# Altium schematic sheet Button_Input_Block.SchDoc
size A; SheetNumber: 8; SheetTotal: 10
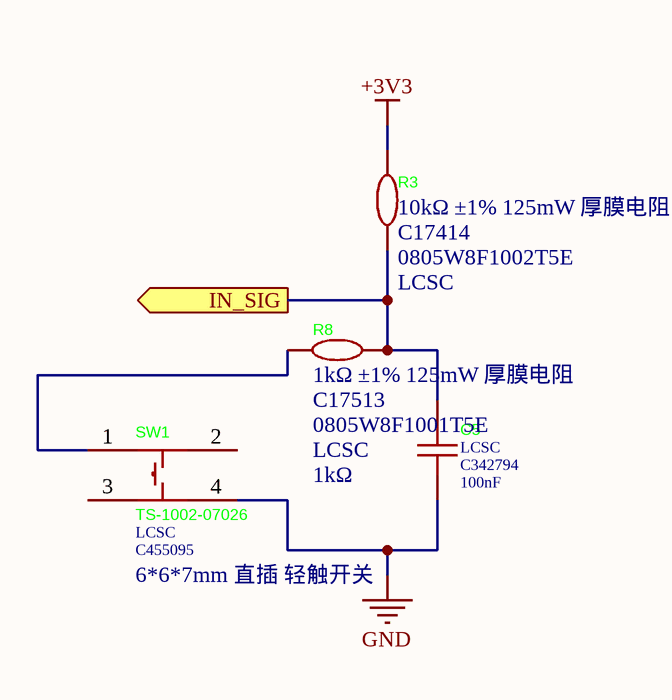
[diagram p0: Button_Input_Block.SchDoc]

## Parts
C5  Supplier: LCSC  Supplier Part: C342794  [CAP-TH_L4.0-W2.5-P5.00-D1.0]  (hidden comment: 100nF)
R3  LCSC Part Name: 10kΩ ±1% 125mW 厚膜电阻  Supplier Part: C17414  Supplier: LCSC  [R0805]  (hidden comment: 10kΩ)
R8  LCSC Part Name: 1kΩ ±1% 125mW 厚膜电阻  Supplier Part: C17513  Supplier: LCSC  [R0805]  (hidden comment: 1kΩ)
SW1  TS-1002-07026  Supplier: LCSC  Supplier Part: C455095  LCSC Part Name: 6*6*7mm 直插 轻触开关  [SW-TH_4P-L6.0-W6.0-P4.50-LS6.5]

## Ports
IN_SIG (out)

## Nets
+3V3: R3.2
GND: C5.1 SW1.4
IN_SIG: C5.2 R3.1 R8.2 ; port IN_SIG
NetR8_1: R8.1 SW1.1

Not connected (* = marked no-connect by the designer): SW1 2 3

## Library data of the parts
C5 = FG28X7R1H104KNT06: Manufacturer: TDK; Add into BOM: yes; Tolerance: ±10%; Voltage Rating: 50V; Temperature Coefficient: X7R; Pin Spacing: 5mm; Symbol: FG28X7R1H104KNT06; Device: FG28X7R1H104KNT06; LCSC Part Name: 100nF ±10% 50V; Manufacturer Part: FG28X7R1H104KNT06; Supplier Footprint: 插件,P=5mm; JLCPCB Part Class: Extended Part; Datasheet: https://item.szlcsc.com/datasheet/FG28X7R1H104KNT06/319644.html; Convert to PCB: yes; Value: 100nF
R3 = 0805W8F1002T5E: Manufacturer: UNI-ROYAL(厚声); Add into BOM: yes; Tolerance: ±1%; Power(Watts): 125mW; Voltage-Supply(Max): 150V; Temperature Coefficient: ±100ppm/℃; Symbol: 0805W8F1002T5E; Device: 0805W8F1002T5E; Value: 10kΩ; Supplier Footprint: 0805; JLCPCB Part Class: Basic Part; Datasheet: https://item.szlcsc.com/datasheet/0805W8F1002T5E/18102.html; Convert to PCB: yes; Type: Thick Film Resistor; Operating Temperature: -55℃~+155℃; Manufacturer Part: 0805W8F1002T5E
R8 = 0805W8F1001T5E: Manufacturer: UNI-ROYAL(厚声); Add into BOM: yes; Tolerance: ±1%; Temperature Coefficient: ±100ppm/℃; Symbol: 0805W8F1001T5E; Device: 0805W8F1001T5E; Supplier Footprint: 0805; JLCPCB Part Class: Basic Part; Datasheet: https://atta.szlcsc.com/upload/public/pdf/source/20200306/C422600_1E6D84923E4A46A82E41ADD87F860B5C.pdf; Convert to PCB: yes; Type: Thick Film Resistors; Operating Temperature Range: -55℃~+155℃; Manufacturer Part: 0805W8F1001T5E; Value: 1kΩ
SW1 = TS-1002-07026: Manufacturer: XUNPU(讯普); Add into BOM: yes; Circuit: SPST; Actuator Style: Round Button; Switch Height: 7mm; Contact Current: 50mA; Voltage Rating: 12V; Symbol: TS-1002-07026; Device: TS-1002-07026; Manufacturer Part: TS-1002-07026; Supplier Footprint: 插件,6x6mm; JLCPCB Part Class: Extended Part; Datasheet: https://item.szlcsc.com/datasheet/TS-1002-07026/457500.html; Convert to PCB: yes; Mounting Type: Through Hole; Length: 6mm; Width: 6mm; With Lamp: -; Life: -